# EAGLE design psx-mc (EAGLE 7.7.0)
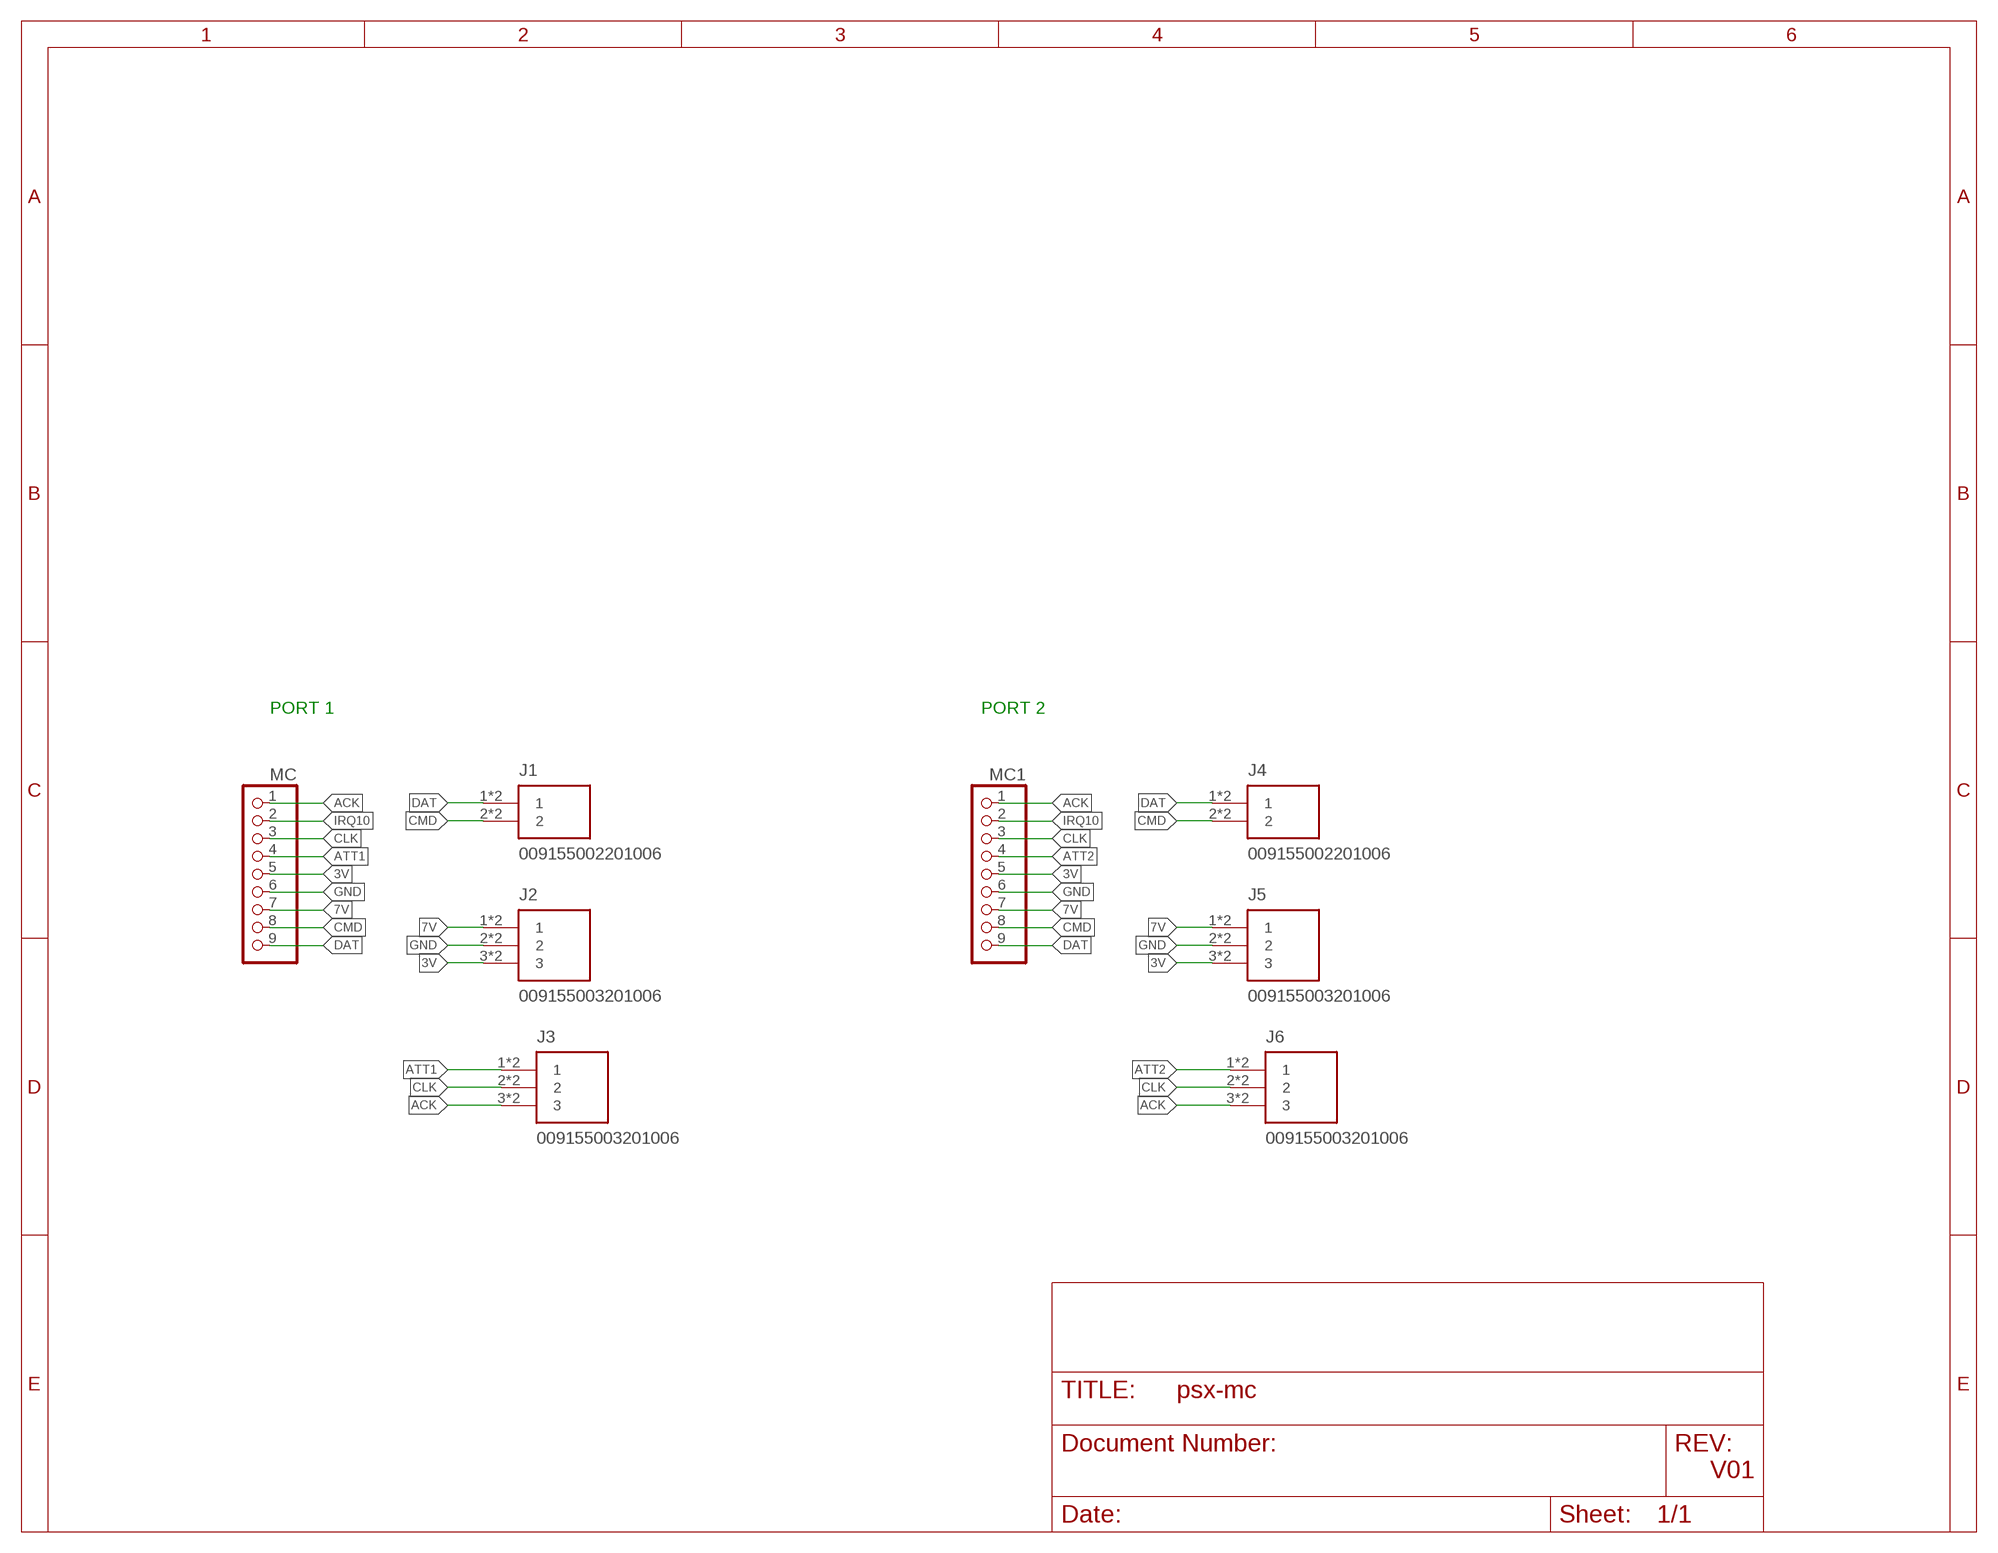
[diagram p0: schematic, sheet 1]

## Parts
J1  009155002201006  [AVX_009155002201006]
J2  009155003201006  [AVX_009155003201006]
J3  009155003201006  [AVX_009155003201006]
J4  009155002201006  [AVX_009155002201006]
J5  009155003201006  [AVX_009155003201006]
J6  009155003201006  [AVX_009155003201006]
MC  PINHD-1X09_2.54-S  [1X09-S]
MC1  PINHD-1X09_2.54-S  [1X09-S]

## Nets
3V: J2.3 J2.3_1 J5.3 J5.3_1 MC1.5 MC.5
7V: J2.1 J2.1_1 J5.1 J5.1_1 MC1.7 MC.7
ACK: J3.3 J3.3_1 J6.3 J6.3_1 MC1.1 MC.1
ATT1: J3.1 J3.1_1 MC.4
ATT2: J6.1 J6.1_1 MC1.4
CLK: J3.2 J3.2_1 J6.2 J6.2_1 MC1.3 MC.3
CMD: J1.2 J1.2_1 J4.2 J4.2_1 MC1.8 MC.8
DAT: J1.1 J1.1_1 J4.1 J4.1_1 MC1.9 MC.9
GND: J2.2 J2.2_1 J5.2 J5.2_1 MC1.6 MC.6
IRQ10: MC1.2 MC.2

## Notes on the sheet
- PORT 1 | PORT 2
- V01

## Library data of the parts
J1 J4 = 009155002201006:009155002201006: 2 Position Spring Battery Contact Connector Surface Mount Check availability <https://pricing.snapeda.com/parts/009155002201006/AVX/view-part?ref=eda>; AVAILABILITY: In Stock; DESCRIPTION: 2 Position Spring Battery Contact Connector Surface Mount; MF: AVX; MP: 009155002201006; PACKAGE: None; PRICE: None; PURCHASE-URL: https://pricing.snapeda.com/search/part/009155002201006/?ref=eda
J2 J3 J5 J6 = 009155003201006:009155003201006: 3 Position Spring Battery Contact Connector Surface Mount Check availability <https://pricing.snapeda.com/parts/009155003201006/AVX/view-part?ref=eda>; AVAILABILITY: In Stock; DESCRIPTION: 3 Position Spring Battery Contact Connector Surface Mount; MF: AVX; MP: 009155003201006; PACKAGE: None; PRICE: None; PURCHASE-URL: https://pricing.snapeda.com/search/part/009155003201006/?ref=eda
MC MC1 = pinhead-2:PINHD-1X09: PIN HEADER

## Board
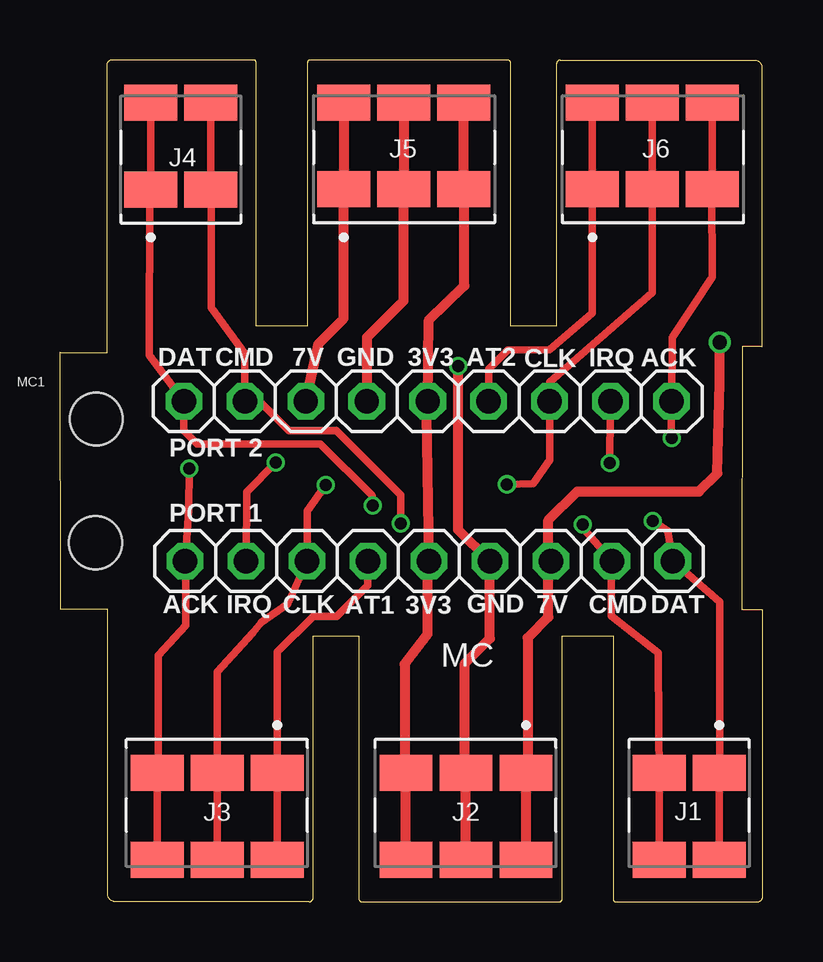
[diagram p1: board, top side]
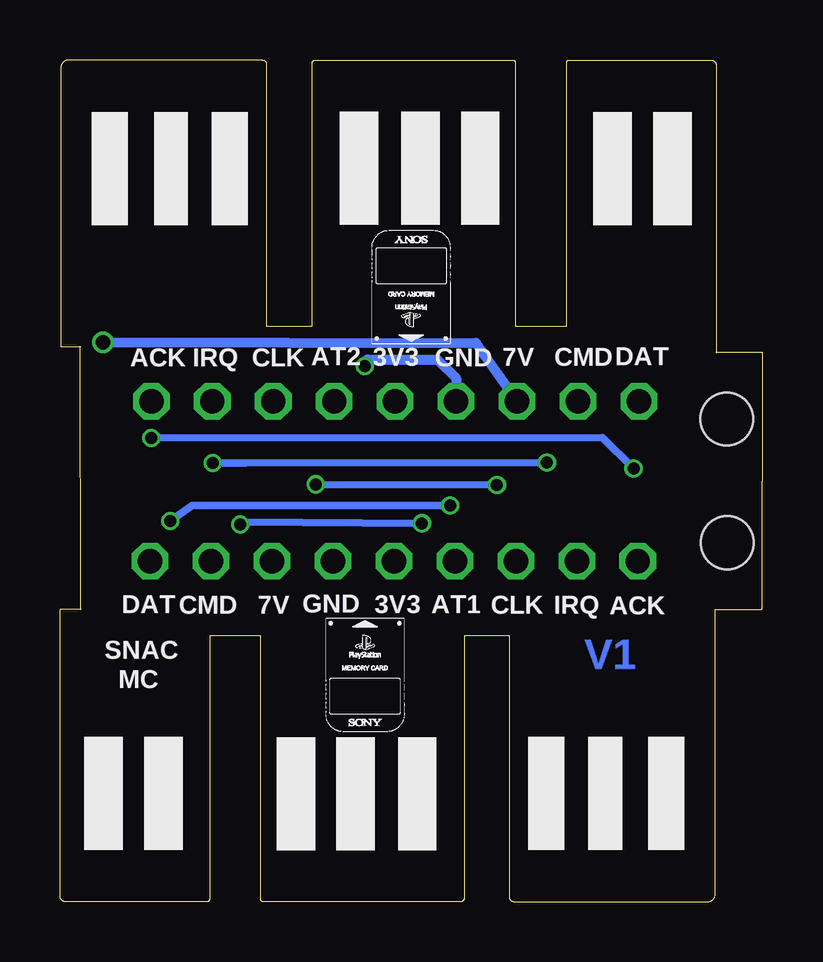
[diagram p2: board, bottom side, seen from below]

Size 29.29 x 35.1 mm. Coordinates in mm from the lower left corner, seen from the top.
Outline: 1.98,12.19 1.98,0.31 arc90 2.34,0 10.38,0 arc90 10.55,0.17 10.55,11.09 12.45,11.09 12.45,0.14 arc90 12.59,0 20.81,0 arc90 20.92,0.11 20.92,11.09 23.05,11.09 23.05,0.11 arc90 23.16,0 29.01,0 arc90 29.29,0.21 29.29,12.19
Outline: 28.41,12.2 29.27,12.2
Outline: 2,12.2 0.04,12.2
Outline: 28.42,12.17 28.44,23.17
Outline: 0.03,12.19 0.01,22.91
Outline: 29.25,23.13 29.25,34.81 arc90 28.89,35.1 20.85,35.1 arc90 20.69,34.93 20.69,24.01 18.78,24.01 18.78,34.96 arc90 18.64,35.1 10.42,35.1 arc90 10.31,34.99 10.31,24.01 8.18,24.01 8.18,34.99 arc90 8.07,35.1 2.22,35.1 arc90 1.94,34.89 1.94,22.88
Outline: 0,22.9 1.96,22.9
Outline: 29.26,23.15 28.42,23.15
Copper layers (1*16): Top 0.035559375mm / dielectric 1.6mm / Bottom 0.035559375mm
Design rules "oshpark-2layer": minimum track width 6mil, minimum drill 10mil, track to track 6mil, track to pad 6mil, pad to pad 6mil, via to via 6mil, smd to smd 6mil, copper to edge 15mil, drill to drill 6mil, minimum pad ring 5mil, minimum via ring 5mil, stop-mask expansion 2.5mil, vias tented up to drill 0mil, thermal gap 10mil
Holes 2.2 mm at 1.48,14.97 1.51,20.13

### Footprints (pad centres in the part's own frame; a part is rotated, then mirrored left to right if it is on the bottom)
AVX_009155002201006 = smd 2.2 x 1.5: 1 -1.25,-1.425; 1_1 -1.25,2.195; 2 1.25,-1.425; 2_1 1.25,2.195
AVX_009155003201006 = smd 2.2 x 1.5: 1 -1.25,-1.425; 1_1 -1.25,2.185; 2 1.25,-1.425; 2_1 1.25,2.185; 3 3.75,-1.425; 3_1 3.75,2.185
1X09-S = drill 1.016 octagon: 1 -10.16,0; 2 -7.62,0; 3 -5.08,0; 4 -2.54,0; 5 0,0; 6 2.54,0; 7 5.08,0; 8 7.62,0; 9 10.16,0

### Placement (x,y rotation side)
J1  26.22,3.95 180 top
J2  18.17,3.95 180 top
J3  7.8,3.95 180 top
J4  5.03,31.12 0 top
J5  13.07,31.13 0 top
J6  23.43,31.13 0 top
MC  15.37,14.21 0 top
MC1  15.32,20.87 180 top

### Tracks (layer width: path | path; a pad name or v marks a point on that pad's centre or on a via)
3V
  Top 0.406: J2.3_1 J2.3 14.36,6.09 14.36,9.92 15.32,11.16 15.32,14.06 MC.5 15.27,20.36 MC1.5 15.37,24.27 16.85,25.69 16.85,29.69 J5.3 J5.3_1
7V  (via drill 0.6)
  Top 0.406: 20.35,14.11 20.35,11.87 19.49,11.01 19.49,5.77 J2.1 J2.1_1 | 20.35,14.11 MC.7 | MC1.7 10.77,23.27 11.82,24.32 J5.1 J5.1_1 | 20.35,14.11 20.35,15.91 21.54,17.11 26.62,17.11 27.39,17.87 27.49,21.65 v27.49,23.33
  Bottom 0.406: v27.49,23.33 11.96,23.3 MC1.7
ACK  (via drill 0.5)
  Top 0.305: J3.3_1 J3.3 4.09,6.12 4.09,10.27 5.24,11.52 5.24,13.93 MC.1 5.36,16.37 v5.39,18.07 | v25.48,19.34 25.48,19.44 MC1.1 25.5,23.53 27.18,26.05 27.16,29.69 J6.3 J6.3_1
  Bottom 0.305: v25.48,19.34 6.69,19.37 v5.39,18.07
ATT1
  Top 0.305: MC.4 12.83,13.19 11.54,11.9 10.55,11.9 9.05,10.43 9.05,5.77 J3.1 J3.1_1
ATT2
  Top 0.305: MC1.4 17.86,22.21 18.65,23 20.4,23.02 22.18,24.55 J6.1 J6.1_1
CLK  (via drill 0.5)
  Top 0.305: J3.2_1 J3.2 6.56,5.76 6.56,9.59 8.03,11.21 8.39,11.64 9.48,12.43 MC.3 10.29,16.29 v11.08,17.39 | J6.2_1 J6.2 24.67,25.41 20.4,21.67 MC1.3 20.4,18.43 19.72,17.44 v18.62,17.41
  Bottom 0.305: v11.08,17.39 v18.62,17.41
CMD  (via drill 0.5)
  Top 0.305: MC.8 22.97,13.98 22.97,11.92 24.92,10.37 24.95,7.15 J1.2 J1.2_1 | MC.8 22.87,14.44 | 6.3,29.2 6.3,24.78 7.7,22.85 MC1.8 8.28,20.89 9.53,19.65 11.51,19.65 14.2,16.95 v14.2,15.78 | 6.3,29.2 6.3,29.68 J4.2 | J4.2_1 6.28,29.22 6.3,29.2 | v21.77,15.73 21.87,15.51 MC.8
  Bottom 0.305: v14.2,15.78 21.65,15.84 v21.77,15.73
DAT  (via drill 0.5)
  Top 0.305: J1.1_1 J1.1 27.49,5.99 27.49,12.51 MC.9 25.33,15.45 v24.69,15.89 | 5.13,20.89 4.95,20.89 | 5.13,20.89 MC1.9 5.16,19.65 5.72,19.09 10.85,19.09 12.98,16.95 13.04,16.83 v13.04,16.52 | 5.13,20.89 3.71,22.8 3.74,29.66 J4.1 J4.1_1
  Bottom 0.305: v13.04,16.52 23.78,16.52 v24.69,15.89
GND  (via drill 0.5)
  Top 0.406: J2.2_1 J2.2 16.87,5.37 16.87,9.94 17.91,10.98 MC.6 16.59,15.51 v16.59,22.34 | J5.2_1 J5.2 14.31,29.69 14.31,25.06 12.78,23.53 MC1.6
  Bottom 0.406: v16.59,22.34 16.46,22.62 13.57,22.62 12.78,21.83 MC1.6
IRQ10  (via drill 0.5)
  Top 0.305: MC1.2 22.91,18.91 v22.92,18.3 | v9,18.32 7.78,17.08 MC.2
  Bottom 0.305: v22.92,18.3 21.54,18.3 v9,18.32

### Text on the board
Bottom: V1
tPlace: DAT | CMD | 7V | GND | 3V3 | AT2 | CLK | IRQ | ACK | PORT 2 | PORT 1 | ACK | IRQ | CLK | AT1 | 3V3 | GND | 7V | CMD | DAT
bPlace: DAT | CMD | 7V | GND | 3V3 | AT2 | CLK | IRQ | ACK | ACK | IRQ | CLK | AT1 | 3V3 | GND | 7V | CMD | DAT | SNAC | MC
tValues: + | -